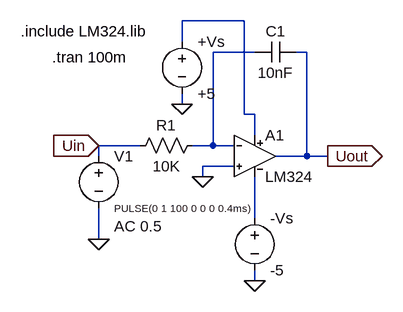
[diagram p0: schematic 3_a.asc]
3_a.asc, the LTspice schematic file:
Version 4.1
SHEET 1 880 680
WIRE 304 -64 208 -64
WIRE 208 -32 208 -64
WIRE 320 -16 256 -16
WIRE 400 -16 384 -16
WIRE 208 64 208 48
WIRE 304 80 304 -64
WIRE 320 80 304 80
WIRE 320 112 320 80
WIRE 144 128 80 128
WIRE 256 128 256 -16
WIRE 256 128 224 128
WIRE 288 128 256 128
WIRE 80 144 80 128
WIRE 400 144 400 -16
WIRE 400 144 352 144
WIRE 432 144 400 144
WIRE 288 160 240 160
WIRE 240 176 240 160
WIRE 320 240 320 176
WIRE 80 272 80 224
WIRE 320 336 320 320
FLAG 240 176 0
FLAG 208 64 0
FLAG 320 336 0
FLAG 80 128 Uin
IOPIN 80 128 In
FLAG 432 144 Uout
IOPIN 432 144 Out
FLAG 80 272 0
SYMBOL LM324 320 144 R0
SYMATTR InstName Α1
SYMBOL res 240 112 R90
WINDOW 0 0 56 VBottom 2
WINDOW 3 32 56 VTop 2
SYMATTR InstName R1
SYMATTR Value 10K
SYMATTR SpiceLine tol=1 pwr=0.1
SYMBOL voltage 208 -48 R0
WINDOW 123 0 0 Left 0
WINDOW 39 0 0 Left 0
SYMATTR InstName +Vs
SYMATTR Value +5
SYMBOL voltage 320 224 R0
WINDOW 123 0 0 Left 0
WINDOW 39 0 0 Left 0
SYMATTR InstName -Vs
SYMATTR Value -5
SYMBOL voltage 80 128 R0
WINDOW 123 24 124 Left 2
WINDOW 39 0 0 Left 0
WINDOW 3 24 96 Left 1
SYMATTR Value2 AC 0.5
SYMATTR Value PULSE(0 1 100 0 0 0 0.4ms)
SYMATTR InstName V1
SYMBOL cap 384 -32 R90
WINDOW 0 0 32 VBottom 2
WINDOW 3 32 32 VTop 2
SYMATTR InstName C1
SYMATTR Value 10nF
TEXT -40 -48 Left 2 !.include LM324.lib
TEXT 8 -8 Left 2 !.tran 100m

The netlist it stands for:
* 3_a.asc
X§Α1 0 N002 N001 N003 Uout LM324  ; pins In+ In- V+ V- OUT
R1 N002 Uin 10K tol=1 pwr=0.1
V§+Vs N001 0 +5
V§-Vs N003 0 -5
V1 Uin 0 PULSE(0 1 100 0 0 0 0.4ms) AC 0.5
C1 Uout N002 10nF
.include LM324.lib
.tran 100m
.backanno
.end